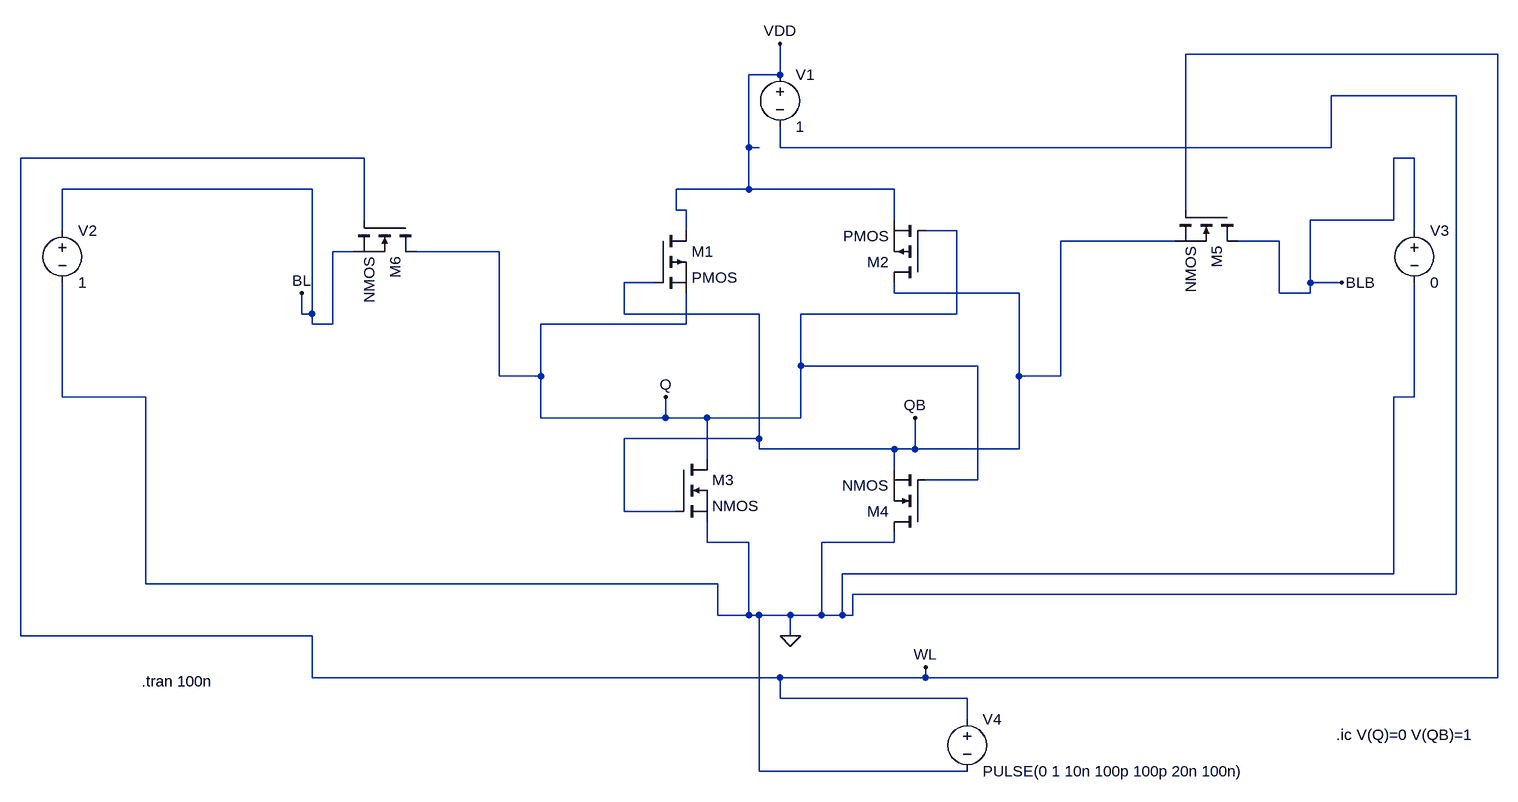
[diagram p0: schematic SRAM_6T_WRITE1.asc]
SRAM_6T_WRITE1.asc, the LTspice schematic file:
Version 4
SHEET 1 1760 680
WIRE 1376 -688 896 -688
WIRE 272 -656 272 -704
WIRE 272 -656 224 -656
WIRE 1312 -624 1120 -624
WIRE 224 -544 224 -656
WIRE 240 -544 224 -544
WIRE 272 -544 272 -576
WIRE 1120 -544 1120 -624
WIRE 1120 -544 272 -544
WIRE -368 -528 -896 -528
WIRE 1248 -528 1216 -528
WIRE -448 -480 -832 -480
WIRE 224 -480 224 -544
WIRE 224 -480 112 -480
WIRE 448 -480 224 -480
WIRE 112 -448 112 -480
WIRE 128 -448 112 -448
WIRE 896 -448 896 -688
WIRE -368 -432 -368 -528
WIRE 448 -432 448 -480
WIRE 1216 -432 1216 -528
WIRE 1216 -432 1088 -432
WIRE -832 -416 -832 -480
WIRE 128 -416 128 -448
WIRE 544 -416 496 -416
WIRE 1248 -416 1248 -528
WIRE 880 -400 704 -400
WIRE 1040 -400 976 -400
WIRE -384 -384 -416 -384
WIRE -160 -384 -288 -384
WIRE 80 -336 32 -336
WIRE 1088 -336 1088 -432
WIRE 1136 -336 1088 -336
WIRE 448 -320 448 -336
WIRE 640 -320 448 -320
WIRE 1040 -320 1040 -400
WIRE 1088 -320 1088 -336
WIRE 1088 -320 1040 -320
WIRE -464 -288 -464 -320
WIRE -448 -288 -448 -480
WIRE -448 -288 -464 -288
WIRE 32 -288 32 -336
WIRE 240 -288 32 -288
WIRE 544 -288 544 -416
WIRE 544 -288 304 -288
WIRE -448 -272 -448 -288
WIRE -416 -272 -416 -384
WIRE -416 -272 -448 -272
WIRE 128 -272 128 -320
WIRE 128 -272 -96 -272
WIRE 304 -208 304 -288
WIRE 576 -208 304 -208
WIRE -160 -192 -160 -384
WIRE -96 -192 -96 -272
WIRE -96 -192 -160 -192
WIRE 640 -192 640 -320
WIRE 704 -192 704 -400
WIRE 704 -192 640 -192
WIRE -832 -160 -832 -336
WIRE -704 -160 -832 -160
WIRE 1248 -160 1248 -336
WIRE 1248 -160 1216 -160
WIRE -96 -128 -96 -192
WIRE 96 -128 96 -160
WIRE 96 -128 -96 -128
WIRE 160 -128 96 -128
WIRE 304 -128 304 -208
WIRE 304 -128 160 -128
WIRE 240 -96 240 -288
WIRE 240 -96 32 -96
WIRE 240 -80 240 -96
WIRE 448 -80 240 -80
WIRE 480 -80 480 -128
WIRE 480 -80 448 -80
WIRE 640 -80 640 -192
WIRE 640 -80 480 -80
WIRE 160 -64 160 -128
WIRE 448 -48 448 -80
WIRE 576 -32 576 -208
WIRE 576 -32 496 -32
WIRE 32 16 32 -96
WIRE 112 16 32 16
WIRE 160 64 160 32
WIRE 224 64 160 64
WIRE 448 64 448 48
WIRE 448 64 336 64
WIRE 1216 112 1216 -160
WIRE 1216 112 368 112
WIRE -704 128 -704 -160
WIRE 176 128 -704 128
WIRE 1312 144 1312 -624
WIRE 1312 144 384 144
WIRE 176 176 176 128
WIRE 224 176 224 64
WIRE 224 176 176 176
WIRE 240 176 224 176
WIRE 288 176 240 176
WIRE 336 176 336 64
WIRE 336 176 288 176
WIRE 368 176 368 112
WIRE 368 176 336 176
WIRE 384 176 384 144
WIRE 384 176 368 176
WIRE -896 208 -896 -528
WIRE -448 208 -896 208
WIRE 288 208 288 176
WIRE -448 272 -448 208
WIRE 272 272 -448 272
WIRE 496 272 496 256
WIRE 496 272 272 272
WIRE 1376 272 1376 -688
WIRE 1376 272 496 272
WIRE 272 304 272 272
WIRE 560 304 272 304
WIRE 560 336 560 304
WIRE 240 416 240 176
WIRE 560 416 240 416
FLAG 288 208 0
FLAG -464 -320 BL
FLAG 1136 -336 BLB
FLAG 272 -704 VDD
FLAG 496 256 WL
FLAG 96 -160 Q
FLAG 480 -128 QB
SYMBOL voltage 272 -672 R0
WINDOW 123 0 0 Left 2
WINDOW 39 0 0 Left 2
SYMATTR InstName V1
SYMATTR Value 1
SYMBOL voltage -832 -432 R0
WINDOW 123 0 0 Left 2
WINDOW 39 0 0 Left 2
SYMATTR InstName V2
SYMATTR Value 1
SYMBOL voltage 1248 -432 R0
WINDOW 123 0 0 Left 2
WINDOW 39 0 0 Left 2
SYMATTR InstName V3
SYMATTR Value 0
SYMBOL voltage 560 320 R0
WINDOW 123 0 0 Left 2
WINDOW 39 0 0 Left 2
SYMATTR InstName V4
SYMATTR Value PULSE(0 1 10n 100p 100p 20n 100n)
SYMBOL pmos 80 -416 R0
SYMATTR InstName M1
SYMBOL pmos 496 -336 R180
SYMATTR InstName M2
SYMBOL nmos 112 -64 R0
SYMATTR InstName M3
SYMBOL nmos 496 48 R180
SYMATTR InstName M4
SYMBOL nmos 976 -448 R90
SYMATTR InstName M5
SYMBOL nmos -288 -432 R90
SYMATTR InstName M6
TEXT -710 278 Left 2 !.tran 100n
TEXT 1128 360 Left 2 !.ic V(Q)=0 V(QB)=1

The netlist it stands for:
* SRAM_6T_WRITE1.asc
V1 VDD 0 1
V2 BL 0 1
V3 BLB 0 0
V4 WL 0 PULSE(0 1 10n 100p 100p 20n 100n)
M1 VDD QB Q Q PMOS
M2 QB Q VDD VDD PMOS
M3 Q QB 0 0 NMOS
M4 0 Q QB QB NMOS
M5 BLB WL QB QB NMOS
M6 Q WL BL BL NMOS
.model NMOS NMOS
.model PMOS PMOS
.lib standard.mos
.tran 100n
.ic V(Q)=0 V(QB)=1
.backanno
.end